# EAGLE design main (EAGLE 9.6.2)
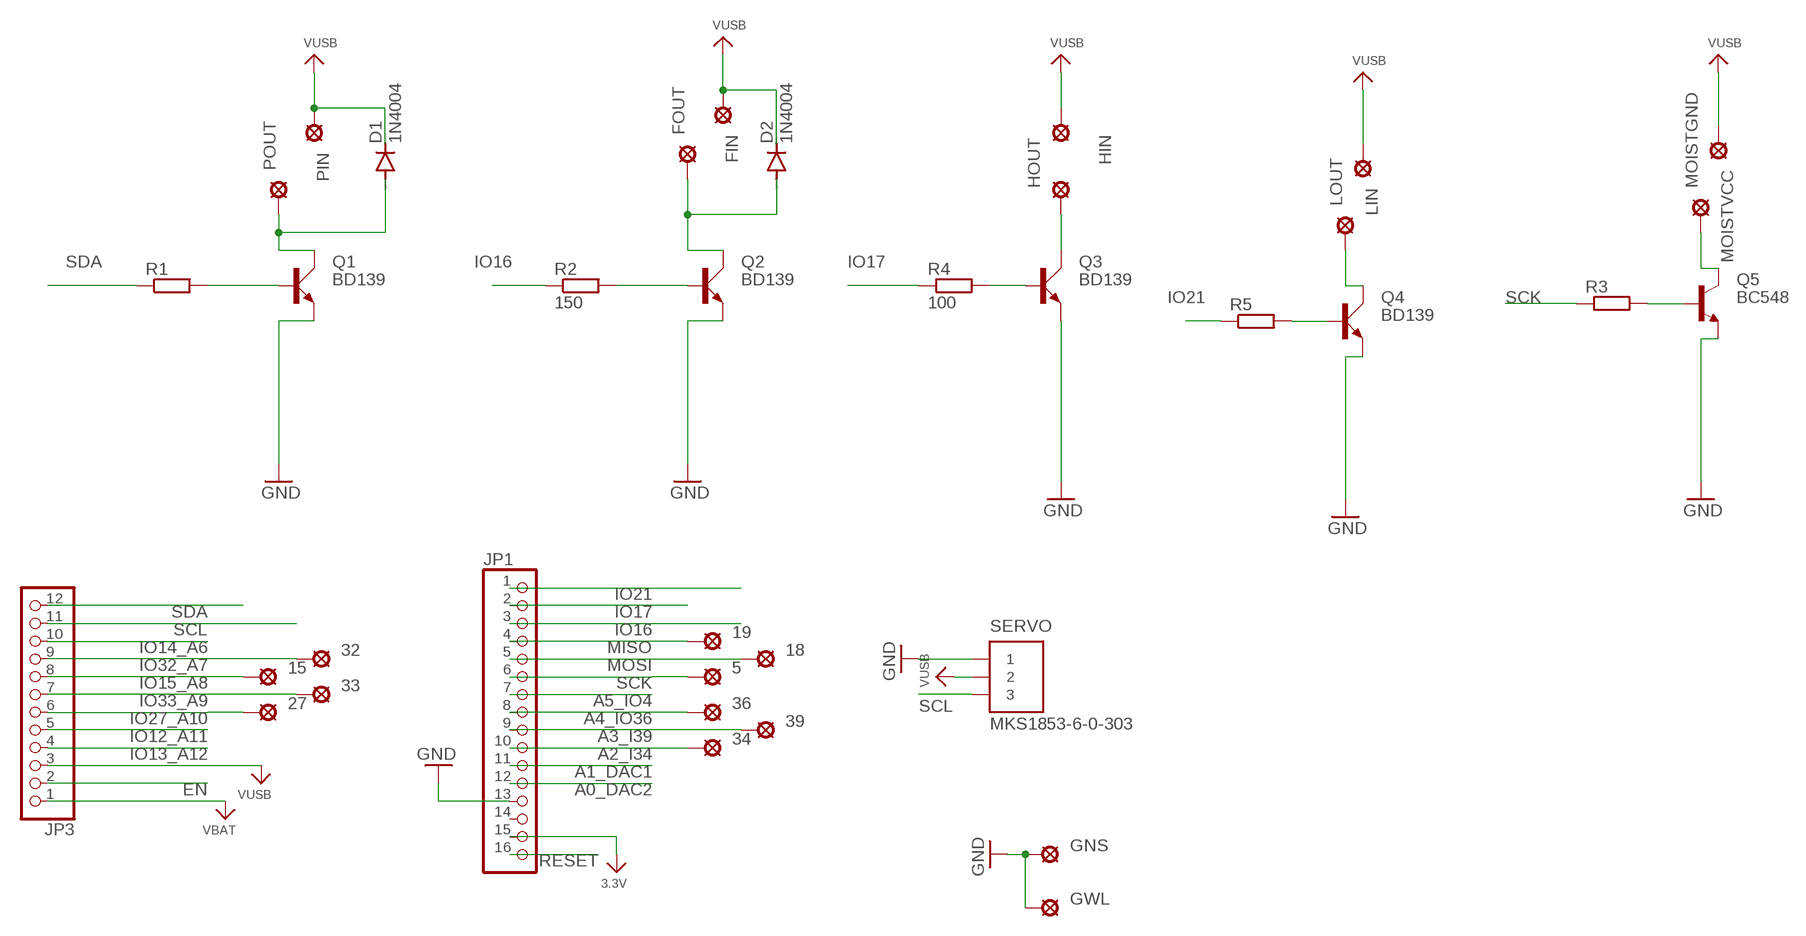
[diagram p0: schematic, sheet 1]

## Parts
5  SE13  [SE13]
15  SE13  [SE13]
18  SE13  [SE13]
19  SE13  [SE13]
27  SE13  [SE13]
32  SE13  [SE13]
33  SE13  [SE13]
34  SE13  [SE13]
36  SE13  [SE13]
39  SE13  [SE13]
D1  1N4004  [DO41-10]
D2  1N4004  [DO41-10]
FIN  SE13  [SE13]
FOUT  SE13  [SE13]
GNS  SE13  [SE13]
GWL  SE13  [SE13]
HIN  SE13  [SE13]
HOUT  SE13  [SE13]
JP1  HEADER-1X16_MIN  [1X16_ROUND_MIN]
JP3  HEADER-1X12_MIN  [1X12_ROUND_MIN]
LIN  SE13  [SE13]
LOUT  SE13  [SE13]
MOISTGND  SE13  [SE13]
MOISTVCC  SE13  [SE13]
PIN  SE13  [SE13]
POUT  SE13  [SE13]
Q1  BD139  [TO126AV]
Q2  BD139  [TO126AV]
Q3  BD139  [TO126AV]
Q4  BD139  [TO126AV]
Q5  BC548  [TO92-EBC]
R1  R-EU_R0805  [R0805]
R2  150  R-EU_R0805  [R0805]
R3  R-EU_R0805  [R0805]
R4  100  R-EU_R0805  [R0805]
R5  R-EU_R0805  [R0805]
SERVO  MKS1853-6-0-303  [MKS1853-6-0-303]

## Nets
3.3V: JP1.15
A0_DAC2: JP1.12
A1_DAC1: JP1.11
A2_I34: 34.MP JP1.10
A3_I39: 39.MP JP1.9
A4_IO36: 36.MP JP1.8
A5_IO4: JP1.7
EN: JP3.2
GND: GNS.MP GWL.MP JP1.13 Q1.E Q2.E Q3.E Q4.E Q5.E SERVO.1
IO12_A11: JP3.5
IO13_A12: JP3.4
IO14_A6: JP3.10
IO15_A8: 15.MP JP3.8
IO16: JP1.3 R2.1
IO17: JP1.2 R4.1
IO21: JP1.1 R5.1
IO27_A10: 27.MP JP3.6
IO32_A7: 32.MP JP3.9
IO33_A9: 33.MP JP3.7
MISO: 19.MP JP1.4
MOSI: 18.MP JP1.5
N$1: Q4.B R5.2
N$2: Q3.B R4.2
N$3: LOUT.MP Q4.C
N$4: HOUT.MP Q3.C
N$5: D2.A FOUT.MP Q2.C
N$6: Q2.B R2.2
N$7: D1.A POUT.MP Q1.C
N$8: Q1.B R1.2
N$9: Q5.B R3.2
N$10: MOISTGND.MP Q5.C
RESET: JP1.16
SCK: 5.MP JP1.6 R3.1
SCL: JP3.11 SERVO.3
SDA: JP3.12 R1.1
VBAT: JP3.1
VBUS: D1.C D2.C FIN.MP HIN.MP JP3.3 LIN.MP MOISTVCC.MP PIN.MP SERVO.2 ; supply symbol labelled VUSB
Unconnected: JP1.14

## Library data of the parts
5 15 18 19 27 32-34 36 39 FIN FOUT GNS GWL HIN HOUT LIN LOUT MOISTGND MOISTVCC PIN POUT = solpad:SE13: SOLDER PAD E1542, drill 1,3mm, distributor Buerklin, 07F815
D1 D2 = diode:1N4004: DIODE general purpose rectifier, 1 A
JP1 = microbuilder:HEADER-1X16: PIN HEADER
JP3 = microbuilder:HEADER-1X12
Q1-Q4 = transistor-power:BD139: NPN TRANSISTOR
Q5 = transistor-npn:BC548*: NPN Transistor
R1-R5 = rcl:R-EU_: RESISTOR, European symbol; SPICEPREFIX: R
SERVO = own-connector:MKS1853-6-0-303: Serie MKS 1850 Lötstifte In-line, Raster 2.5 mm, Stiftwannen, stehend, mit Rastlasche Source: http://www.stocko.de/de/index.php?seite=ka_rfk2_mks1850.html&rubrik=Katalog+-+RFK+2 rfk_1850.pdf; OC_FARNELL: 1141861; OC_NEWARK: unknown

## Board
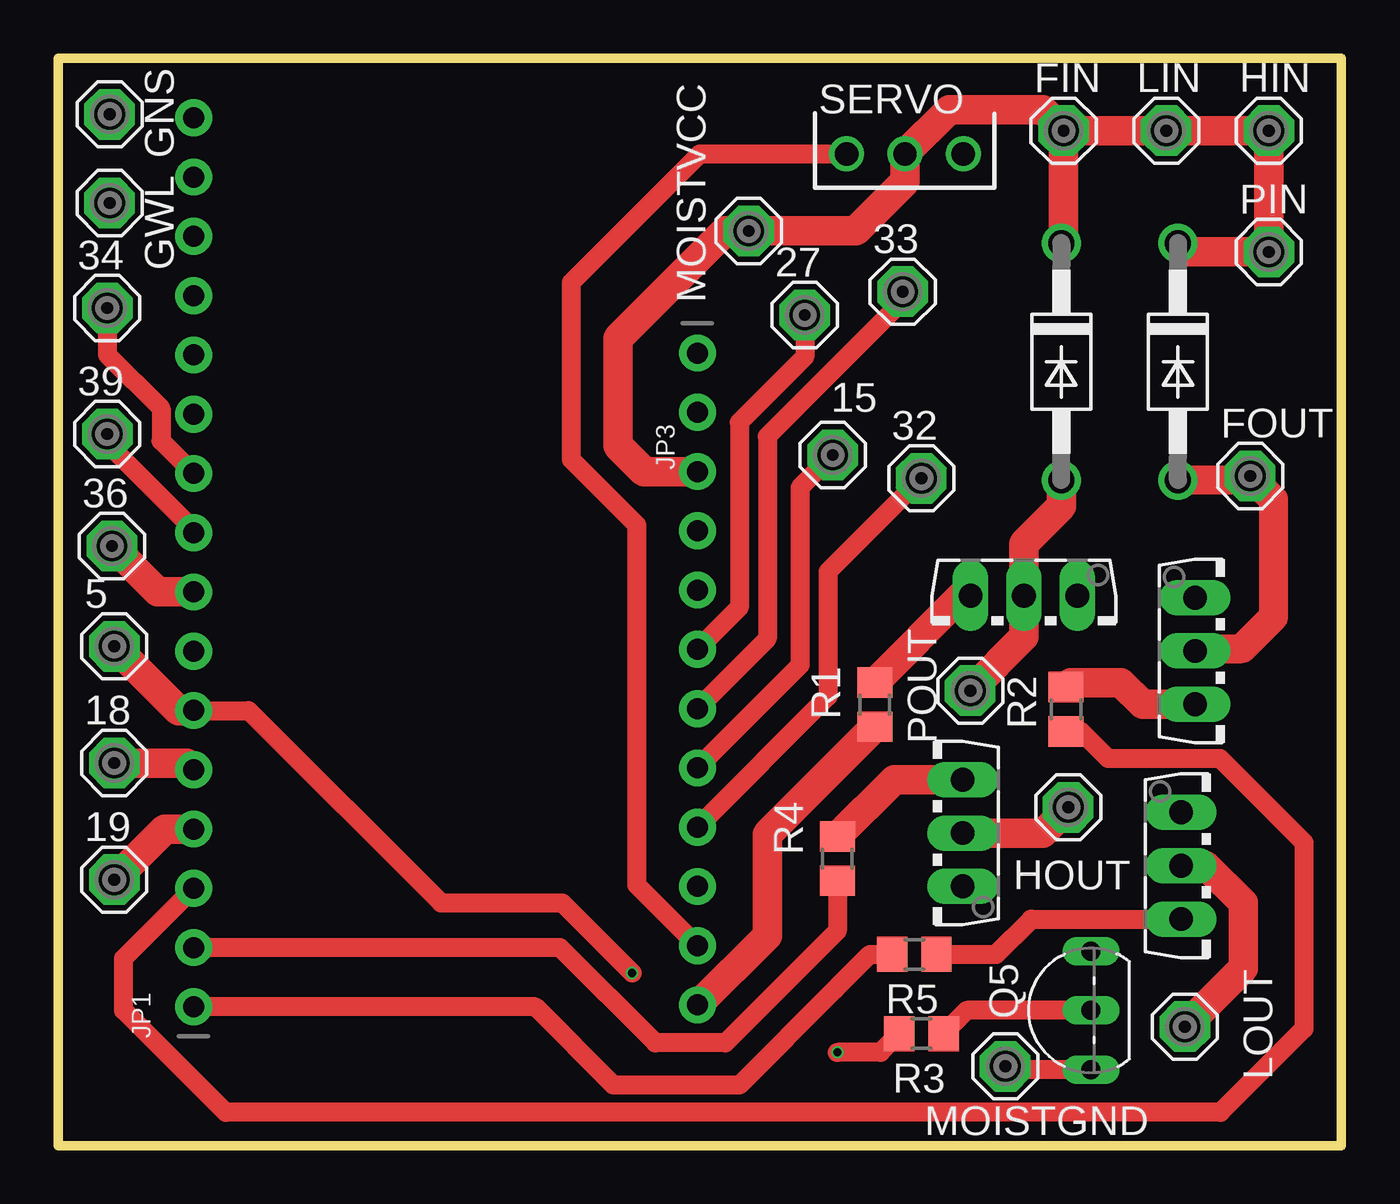
[diagram p1: board, top side]
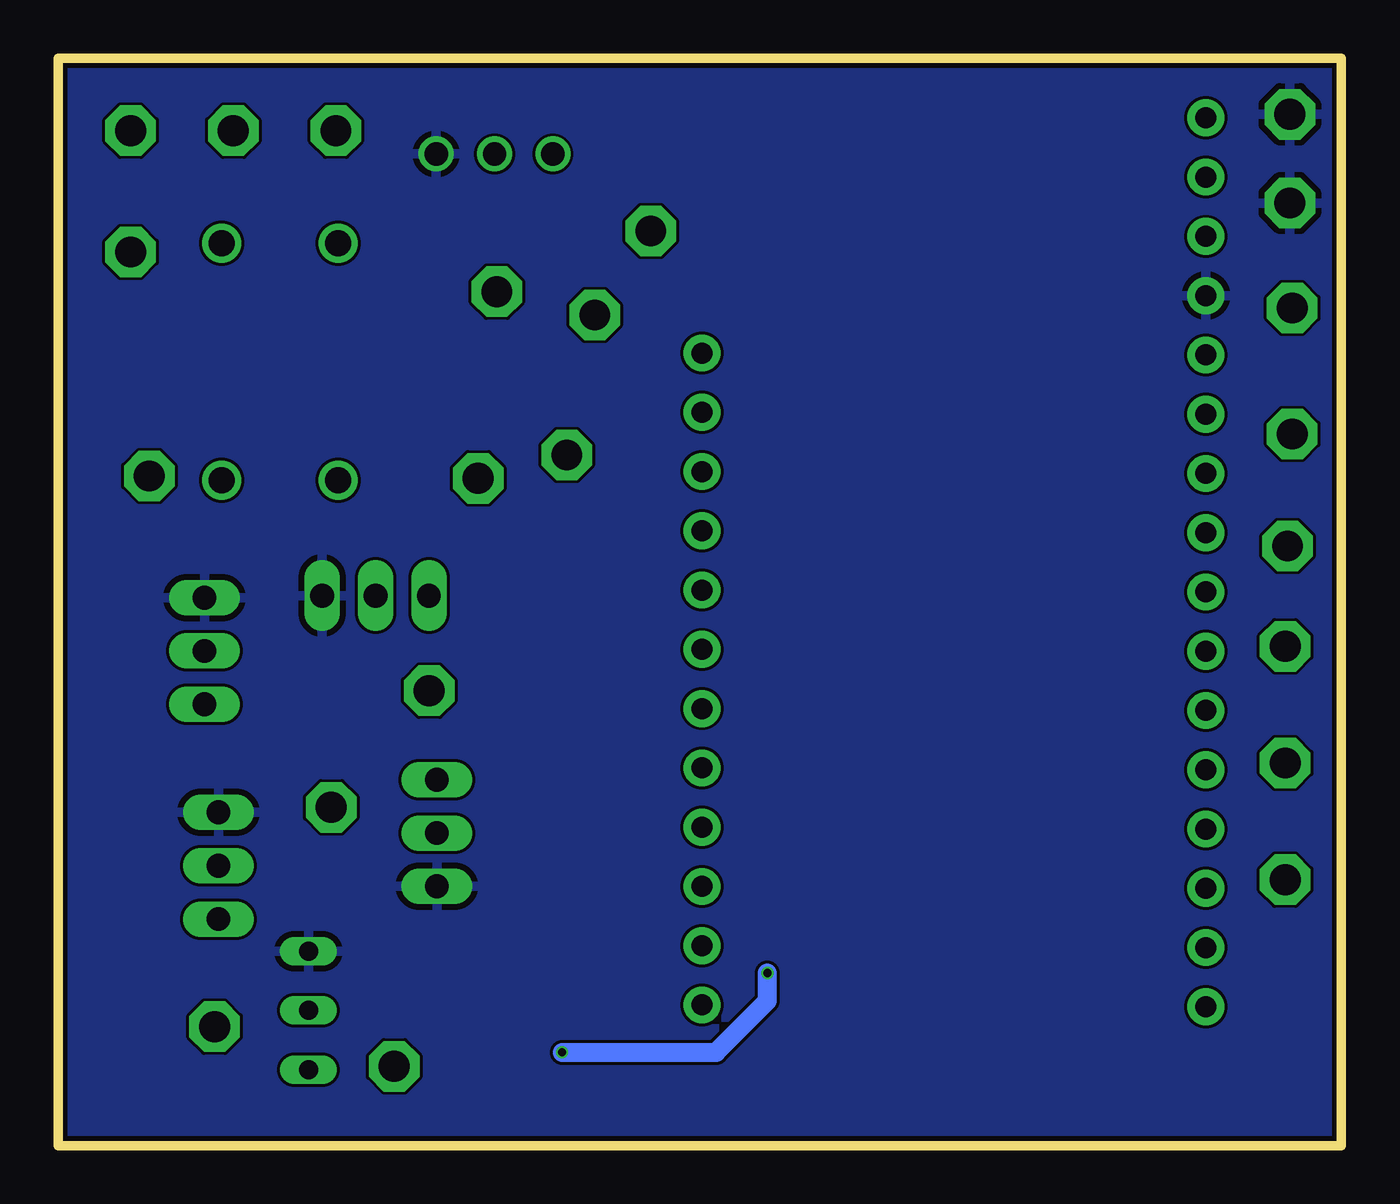
[diagram p2: board, bottom side, seen from below]

Size 55 x 46.6 mm. Coordinates in mm from the lower left corner, seen from the top.
Outline: 0,0 55,0 55,46.6 0,46.6 0,0
Copper layers (1*16): Top 0.035559375mm / dielectric 1.6mm / Bottom 0.035559375mm
Design rules "jlcpcb2layer": minimum track width 5mil, minimum drill 12mil, track to track 5mil, track to pad 5mil, pad to pad 5mil, via to via 5mil, smd to smd 5mil, copper to edge 8mil, drill to drill 6mil, minimum pad ring 5mil, minimum via ring 3mil, stop-mask expansion 2.5mil, vias tented up to drill 0mil, thermal gap 10mil

### Footprints (pad centres in the part's own frame; a part is rotated, then mirrored left to right if it is on the bottom)
SE13 = drill 1.321 pad 2.159 octagon: MP 0,0
DO41-10 = drill 1.118: A 5.08,0; C -5.08,0
1X16_ROUND_MIN = drill 0.9 pad 1.575: 1 -19.05,0; 2 -16.51,0; 3 -13.97,0; 4 -11.43,0; 5 -8.89,0; 6 -6.35,0; 7 -3.81,0; 8 -1.27,0; 9 1.27,0; 10 3.81,0; 11 6.35,0; 12 8.89,0; 13 11.43,0; 14 13.97,0; 15 16.51,0; 16 19.05,0
1X12_ROUND_MIN = drill 0.9 pad 1.575: 1 -13.97,0; 2 -11.43,0; 3 -8.89,0; 4 -6.35,0; 5 -3.81,0; 6 -1.27,0; 7 1.27,0; 8 3.81,0; 9 6.35,0; 10 8.89,0; 11 11.43,0; 12 13.97,0
TO126AV = drill 1.016 long: B 2.286,-1.27; C 0,-1.27; E -2.286,-1.27
TO92-EBC = drill 0.813 long: B 0,-1.27; C -2.54,-1.27; E 2.54,-1.27
R0805 = smd 1.3 x 1.5: 1 -0.95,0; 2 0.95,0
MKS1853-6-0-303 = drill 1 pad 1.422: 1 -2.5,0; 2 0,0; 3 2.5,0

### Placement (x,y rotation side)
5  2.4,21.4 0 top
15  33.2,29.6 0 top
18  2.4,16.4 0 top
19  2.4,11.4 0 top
27  32,35.6 0 top
32  37,28.6 0 top
33  36.2,36.6 0 top
34  2.1,35.9 0 top
36  2.3,25.7 0 top
39  2.1,30.5 0 top
D1  43,33.6 270 top
D2  48,33.6 270 top
FIN  43.1,43.5 0 top
FOUT  51.1,28.7 0 top
GNS  2.2,44.2 0 top
GWL  2.2,40.4 0 top
HIN  51.9,43.5 0 top
HOUT  43.3,14.5 0 top
JP1  5.8,25 90 top
JP3  27.4,20 270 top
LIN  47.5,43.5 0 top
LOUT  48.3,5.1 0 top
MOISTGND  40.6,3.4 0 top
MOISTVCC  29.6,39.2 0 top
PIN  51.9,38.3 0 top
POUT  39.1,19.5 0 top
Q1  41.4,22.3 180 top
Q2  50,21.2 270 top
Q3  37.5,13.4 90 top
Q4  49.4,12 270 top
Q5  43,5.8 90 top
R1  35,18.9 90 top
R2  43.2,18.7 90 top
R3  37,4.8 0 top
R4  33.4,12.3 90 top
R5  36.7,8.2 0 top
SERVO  36.3,42.5 180 top

### Tracks (layer width: path | path; a pad name or v marks a point on that pad's centre or on a via)
A2_I34
  Top 0.813: 34.MP 2.1,33.9 4.4,31.6 4.4,30.21 JP1.10
A3_I39
  Top 0.813: 39.MP 2.1,30.1 5.8,26.4 JP1.9
A4_IO36
  Top 1.27: 36.MP 4.27,23.73 JP1.8
GND
  pour Bottom: 0,46.6 55,46.6 55,0 0,0
IO15_A8
  Top 0.813: 15.MP 31.8,28.2 31.8,20.59 JP3.8
IO16
  Top 0.813: R2.1 43.85,17.75 45,16.6 49.8,16.6 53.4,13 53.4,5 49.82,1.42 7.18,1.42 2.8,5.8 2.8,8.03 JP1.3
IO17
  Top 0.813: R4.1 33.4,9.2 28.6,4.4 25.6,4.4 21.51,8.49 JP1.2
IO21
  Top 0.813: JP1.1 20.45,5.95 23.8,2.6 29.2,2.6 33.3,6.7 33.4,6.8 34.8,8.2 R5.1
IO27_A10
  Top 0.813: 27.MP 32,33.8 29.2,31 29.2,23.07 JP3.6
IO32_A7
  Top 0.813: JP3.9 33,19.25 33,24.6 32.MP
IO33_A9
  Top 0.813: 33.MP 36.2,36.2 30.4,30.4 30.4,21.73 JP3.7
MISO
  Top 1.27: 19.MP 4.57,13.57 JP1.4
MOSI
  Top 1.27: 18.MP 5.51,16.4 JP1.5
N$1
  Top 0.813: R5.2 40.2,8.2 41.71,9.71 Q4.B
N$2
  Top 1.27: Q3.B 35.84,15.69 R4.2
N$3
  Top 1.27: Q4.C 49.2,12 50.8,10.4 50.8,7.6 LOUT.MP
N$4
  Top 1.27: HOUT.MP 42.2,13.4 Q3.C
N$5
  Top 1.25: Q2.C 48.83,21.3 50.75,21.3 52.1,22.65 52.1,27.7 FOUT.MP 50.92,28.52 D2.A
N$6
  Top 1.27: R2.2 43.4,19.85 45.55,19.85 46.49,18.91 Q2.B
N$7
  Top 1.27: D1.A 43,27.4 41.4,25.8 Q1.C 41.4,21.8 POUT.MP
N$8
  Top 1.27: R1.2 38.72,23.57 Q1.B
N$9
  Top 0.813: Q5.B 38.95,5.8 R3.2
N$10
  Top 0.813: Q5.C 40.74,3.26 MOISTGND.MP
SCK  (via drill 0.35)
  Top 0.813: R3.1 35.25,4 v33.4,4 | JP1.6 8.15,18.65 16.4,10.4 21.6,10.4 v24.6,7.4
  Top 1.27: 5.MP 5.15,18.65 JP1.6
  Bottom 0.813: v33.4,4 26.8,4 24.6,6.2 v24.6,7.4
SCL
  Top 0.813: JP3.11 24.8,11.17 24.8,26.6 22,29.4 22,37 27.5,42.5 SERVO.3
SDA
  Top 1.27: R1.1 30.4,13.35 30.4,9 27.43,6.03 JP3.12
VBUS
  Top 1.27: JP3.3 25.11,28.89 24,30 24,34.6 28.6,39.2 MOISTVCC.MP 34.2,39.2 36.3,41.3 SERVO.2 38.2,44.4 42.2,44.4 FIN.MP | FIN.MP LIN.MP HIN.MP PIN.MP 48.38,38.3 D2.C | FIN.MP 43.1,38.78 D1.C